# Altium schematic sheet protection_DC.SchDoc
size A4
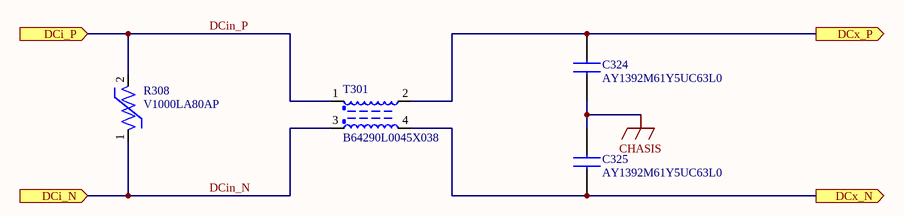
[diagram p0: protection_DC.SchDoc]

## Parts
C324  AY1392M61Y5UC63L0  [AY1392M61Y5UC63L0]
C325  AY1392M61Y5UC63L0  [AY1392M61Y5UC63L0]
R308  V1000LA80AP  [V1000LA80AP]
T301  B64290L0045X038  [B64290L0045X038]

## Ports
DCi_N (in), DCi_P (in), DCx_N (out), DCx_P (out)

## Nets
CHASIS: C324.2 C325.1
DCin_N: R308.1 T301.3 ; port DCi_N
DCin_P: R308.2 T301.1 ; port DCi_P
DCx_N: C325.2 T301.4 ; port DCx_N
DCx_P: C324.1 T301.2 ; port DCx_P

## Library data of the parts
C324 C325 = AY1392M61Y5UC63L0: Cap Ceramic 0.0039uF 1500V Y5U 20% Through Hole 10mm Radial 125°C Bulk; Manufacturer: Vishay; Value: 3.9 nF; Manufacturer Part Number: AY1392M61Y5UC63L0; Stock 1: 472; Pricing 1: 1=0,81000, 10=0,61800, 100=0,44180, 500=0,34200, 1000=0,29450, 2500=0,27550, 5000=0,26125 (USD); Supplier 1: Digi-Key; Supplier 2: Farnell; Supplier 3: Newark; Supplier Part Number 3: 95AC5614; Supplier Part Number 2: 2987310; Supplier Part Number 1: BC5432-ND
R308 = V1000LA80AP: Varistors 1000V 130pF; Manufacturer: Littelfuse; Max Voltage Rating (AC): 1kV; Max Voltage Rating (DC): 1.2kV; Number of Circuits: 1; Energy: 220J; Max Surge Current: 4.5kA; Min Varistor Voltage: 1.5kV; Varistor Voltage: 1.8kV; Clamping Voltage: 2.7kV; Clamping Current: 50A; Lead/Base Style: Radial; Manufacturer Part Number: V1000LA80AP; RoHS: Yes; Category: Varistors; Stock 1: 1833; Pricing 1: 1=2,50000, 10=2,26200, 25=2,02000, 100=1,81800, 250=1,61600, 500=1,41400, 1000=1,17160, 2500=1,09080, 5000=1,05040 (USD); Mount: Through Hole,Radial; Min Operating Temperature: -55°C; Max Operating Temperature: 85°C; Packaging: Bulk; Max Varistor Voltage: 1.8kV; Termination: Radial; Package Quantity: 300; Voltage Rating: 1.2kV; Voltage Rating (DC): 1.2kV; Voltage Rating (AC): 1kV; Capacitance: 130pF; Max Output Current: 4.5kA; Current Rating: 4.5kA; Diameter: 14mm; Depth: 10.8mm; Thickness: 10.8mm; Width: 10.8mm; Lead Pitch: 8.5mm; REACH SVHC: Unknown; Lead Free: Lead Free; ComponentLink1URL: https://datasheet.ciiva.com/25604/0900766b81107157-25604568.pdf?src-supplier=RSComponents; ComponentLink1Description: https://datasheet.ciiva.com/25604/0900766b81107157-25604568.pdf?src-supplier=RSComponents; ComponentLink2URL: https://datasheet.ciiva.com/366/littelfuse-mov-la-366032.pdf?src-supplier=Digi-Key; ComponentLink2Description: https://datasheet.ciiva.com/366/littelfuse-mov-la-366032.pdf?src-supplier=Digi-Key; ComponentLink3URL: https://datasheet.ciiva.com/15155/getdatasheetpartid-97401-15155450.pdf?src-supplier=Verical; ComponentLink3Description: https://datasheet.ciiva.com/15155/getdatasheetpartid-97401-15155450.pdf?src-supplier=Verical; ComponentLink4URL: https://datasheet.ciiva.com/16379/la-16379084.pdf?src-supplier=Future+Electronics; ComponentLink4Description: https://datasheet.ciiva.com/16379/la-16379084.pdf?src-supplier=Future+Electronics; ComponentLink5URL: https://datasheet.ciiva.com/8070/482376-8070941.pdf?src-supplier=Element14; ComponentLink5Description: https://datasheet.ciiva.com/8070/482376-8070941.pdf?src-supplier=Element14; ComponentLink6URL: https://datasheet.ciiva.com/4540/littelfuse-mov-la-34212-4540703.pdf?src-supplier=Mouser; ComponentLink6Description: https://datasheet.ciiva.com/4540/littelfuse-mov-la-34212-4540703.pdf?src-supplier=Mouser; Supplier 1: Digi-Key; Supplier 2: Arrow; Supplier 3: Future Electronics; Supplier 4: Mouser; Supplier 5: Farnell; Supplier 6: Newark; Supplier 7: Newark; Supplier Part Number 7: 58K7189; Supplier Part Number 6: 80R8723; Supplier Part Number 5: 1816971; Supplier Part Number 4: 576-V1000LA80AP; Supplier Part Number 3: V1000LA80AP-BOX; Supplier Part Number 1: F3029-ND; Supplier Part Number 2: V1000LA80AP
T301 = B64290L0045X038: FERRITE CORE TOROID 6.44UH T38; Manufacturer: TDK; Shape: Cylindrical; Manufacturer Part Number: B64290L0045X038; RoHS: Yes; Category: Uncategorized; Stock 1: 6794; Pricing 1: 1=0,79000, 10=0,71000, 25=0,52600, 50=0,49980, 100=0,44710, 250=0,42080, 500=0,39450, 1000=0,34190, 5000=0,32875 (USD); Package Quantity: 2000; Packaging: Bulk; Diameter: 17.2mm; ComponentLink1URL: http://components.arrow.com/part/dataview/0323_01888516?src-supplier=Arrow+Europe; ComponentLink1Description: http://components.arrow.com/part/dataview/0323_01888516?src-supplier=Arrow+Europe; ComponentLink2URL: https://www.verical.com/server-webapp/html/getDatasheet?partID=477647&src-supplier=Verical; ComponentLink2Description: https://www.verical.com/server-webapp/html/getDatasheet?partID=477647&src-supplier=Verical; ComponentLink3URL: http://www.epcos.com/inf/80/db/fer_07/r_16.pdf?src-supplier=Avnet; ComponentLink3Description: http://www.epcos.com/inf/80/db/fer_07/r_16.pdf?src-supplier=Avnet; ComponentLink4URL: https://en.tdk.eu/download/531586/2d679ff7e70f74dfb98dc2a4732cca7b/pdf-toroids-general-information.pdf?src-supplier=Digi-Key; ComponentLink4Description: https://en.tdk.eu/download/531586/2d679ff7e70f74dfb98dc2a4732cca7b/pdf-toroids-general-information.pdf?src-supplier=Digi-Key; Supplier 1: Digi-Key; Supplier 2: Arrow; Supplier 3: Farnell; Supplier 4: Newark; Supplier Part Number 4: 02AC3431; Supplier Part Number 3: 2673401; Supplier Part Number 2: B64290L0045X038; Supplier Part Number 1: 495-3854-ND